# Altium schematic sheet peripherals.SchDoc
size A
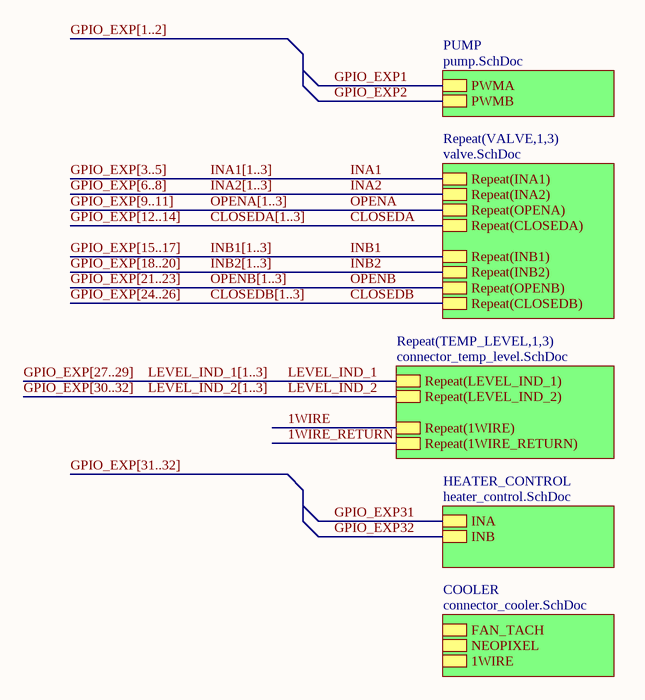
[diagram p0: peripherals.SchDoc]

## Sub-sheets
COOLER = connector_cooler.SchDoc: NEOPIXEL, FAN_TACH, 1WIRE
HEATER_CONTROL = heater_control.SchDoc: INA, INB
PUMP = pump.SchDoc: PWMB, PWMA
Repeat(TEMP_LEVEL,1,3) = connector_temp_level.SchDoc: Repeat(1WIRE), Repeat(LEVEL_IND_2), Repeat(LEVEL_IND_1), Repeat(1WIRE_RETURN)
Repeat(VALVE,1,3) = valve.SchDoc: Repeat(INB2), Repeat(INB1), Repeat(INA2), Repeat(INA1), Repeat(CLOSEDA), Repeat(OPENA), Repeat(CLOSEDB), Repeat(OPENB)

## Nets
1WIRE: sheet Repeat(TEMP_LEVEL,1,3)/Repeat(1WIRE)
1WIRE_RETURN: sheet Repeat(TEMP_LEVEL,1,3)/Repeat(1WIRE_RETURN)
CLOSEDA: sheet Repeat(VALVE,1,3)/Repeat(CLOSEDA)
CLOSEDB: sheet Repeat(VALVE,1,3)/Repeat(CLOSEDB)
GPIO_EXP1: sheet PUMP/PWMA
GPIO_EXP2: sheet PUMP/PWMB
GPIO_EXP31: sheet HEATER_CONTROL/INA
GPIO_EXP32: sheet HEATER_CONTROL/INB
INA1: sheet Repeat(VALVE,1,3)/Repeat(INA1)
INA2: sheet Repeat(VALVE,1,3)/Repeat(INA2)
INB1: sheet Repeat(VALVE,1,3)/Repeat(INB1)
INB2: sheet Repeat(VALVE,1,3)/Repeat(INB2)
LEVEL_IND_1: sheet Repeat(TEMP_LEVEL,1,3)/Repeat(LEVEL_IND_1)
LEVEL_IND_2: sheet Repeat(TEMP_LEVEL,1,3)/Repeat(LEVEL_IND_2)
OPENA: sheet Repeat(VALVE,1,3)/Repeat(OPENA)
OPENB: sheet Repeat(VALVE,1,3)/Repeat(OPENB)

## Buses and harness runs
bus CLOSEDA[1..3] = GPIO_EXP[12..14]
bus CLOSEDB[1..3] = GPIO_EXP[24..26]
bus GPIO_EXP[1..2]
bus GPIO_EXP[3..5] = INA1[1..3]
bus GPIO_EXP[6..8] = INA2[1..3]
bus GPIO_EXP[9..11] = OPENA[1..3]
bus GPIO_EXP[15..17] = INB1[1..3]
bus GPIO_EXP[18..20] = INB2[1..3]
bus GPIO_EXP[21..23] = OPENB[1..3]
bus GPIO_EXP[27..29] = LEVEL_IND_1[1..3]
bus GPIO_EXP[30..32] = LEVEL_IND_2[1..3]
bus GPIO_EXP[31..32]